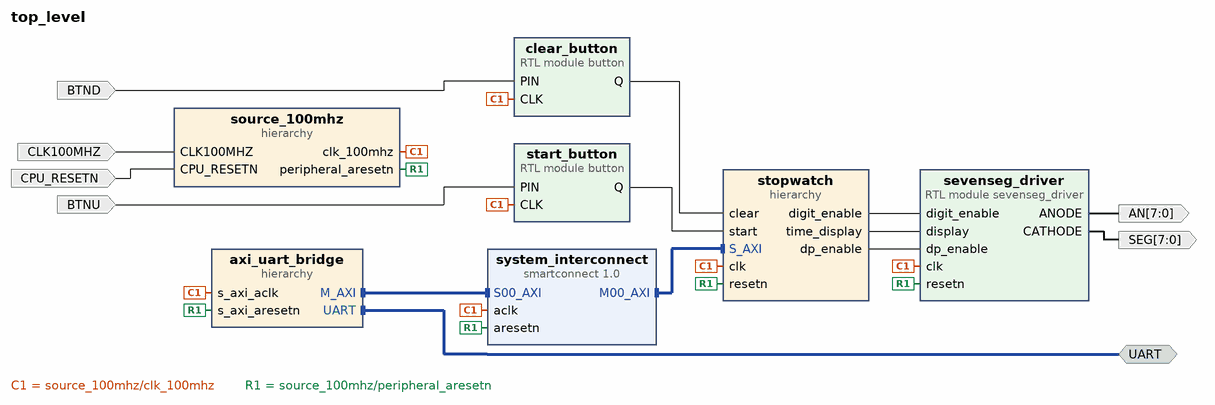
[diagram p0: block diagram of the top level]
# Vivado block design top_level, xc7a100tcsg324-1, Vivado 2021.1
create_bd_design top_level

create_bd_intf_port -mode Master -vlnv xilinx.com:interface:uart_rtl:1.0 UART
create_bd_port -dir I -type clk CLK100MHZ
create_bd_port -dir I -type rst CPU_RESETN
create_bd_port -dir O -from 7 -to 0 AN
create_bd_port -dir O -from 7 -to 0 SEG
create_bd_port -dir I BTNU
create_bd_port -dir I BTND

create_bd_cell -type hier source_100mhz
create_bd_cell -type ip -vlnv xilinx.com:ip:smartconnect:1.0 system_interconnect
set_property -dict {CONFIG.NUM_SI 1} [get_bd_cells system_interconnect]
create_bd_cell -type hier axi_uart_bridge
create_bd_cell -type module -reference sevenseg_driver sevenseg_driver
create_bd_cell -type module -reference button start_button
create_bd_cell -type module -reference button clear_button
create_bd_cell -type hier stopwatch

# ---- hierarchy /source_100mhz ----
current_bd_instance /source_100mhz
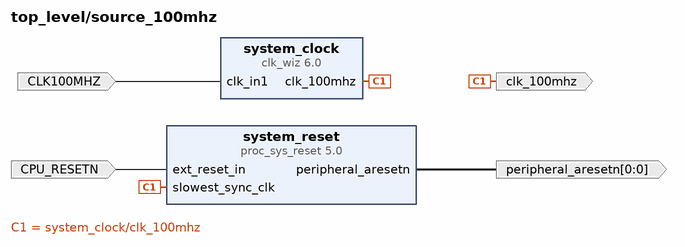
[diagram p1: block diagram inside /source_100mhz]
create_bd_pin -dir I -type clk CLK100MHZ
create_bd_pin -dir I -type rst CPU_RESETN
create_bd_pin -dir O -from 0 -to 0 peripheral_aresetn
create_bd_pin -dir O clk_100mhz

create_bd_cell -type ip -vlnv xilinx.com:ip:clk_wiz:6.0 system_clock
set_property -dict {CONFIG.CLK_OUT1_PORT clk_100mhz CONFIG.USE_LOCKED false CONFIG.USE_RESET false} [get_bd_cells system_clock]
create_bd_cell -type ip -vlnv xilinx.com:ip:proc_sys_reset:5.0 system_reset

# ---- hierarchy /axi_uart_bridge ----
current_bd_instance /axi_uart_bridge
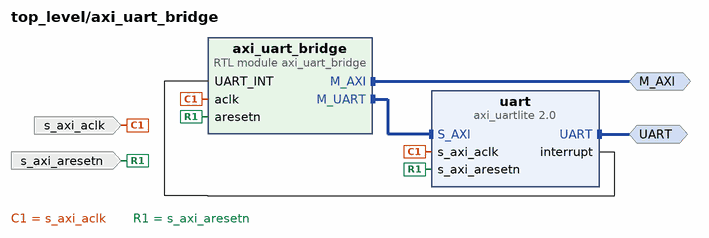
[diagram p2: block diagram inside /axi_uart_bridge]
create_bd_intf_pin -mode Master -vlnv xilinx.com:interface:aximm_rtl:1.0 M_AXI
create_bd_intf_pin -mode Master -vlnv xilinx.com:interface:uart_rtl:1.0 UART
create_bd_pin -dir I -type clk s_axi_aclk
create_bd_pin -dir I -type rst s_axi_aresetn

create_bd_cell -type module -reference axi_uart_bridge axi_uart_bridge
create_bd_cell -type ip -vlnv xilinx.com:ip:axi_uartlite:2.0 uart
set_property -dict {CONFIG.C_BAUDRATE 115200} [get_bd_cells uart]

# ---- hierarchy /stopwatch ----
current_bd_instance /stopwatch
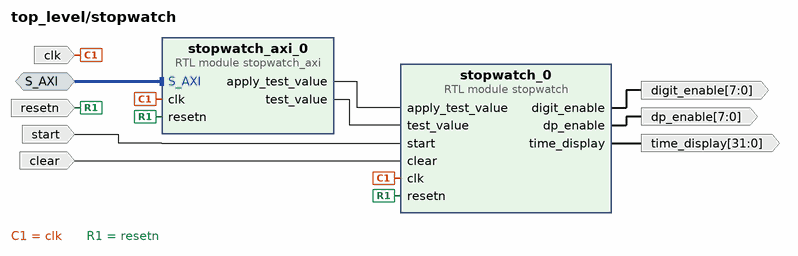
[diagram p3: block diagram inside /stopwatch]
create_bd_intf_pin -mode Slave -vlnv xilinx.com:interface:aximm_rtl:1.0 S_AXI
create_bd_pin -dir I -type clk clk
create_bd_pin -dir I -type rst resetn
create_bd_pin -dir O -from 7 -to 0 dp_enable
create_bd_pin -dir O -from 7 -to 0 digit_enable
create_bd_pin -dir O -from 31 -to 0 time_display
create_bd_pin -dir I clear
create_bd_pin -dir I start

create_bd_cell -type module -reference stopwatch_axi stopwatch_axi_0
create_bd_cell -type module -reference stopwatch stopwatch_0

# ---- connections ----

current_bd_instance /source_100mhz
connect_bd_net -net clk_in1_0_1 [get_bd_pins CLK100MHZ] [get_bd_pins system_clock/clk_in1]
connect_bd_net -net ext_reset_in_0_1 [get_bd_pins CPU_RESETN] [get_bd_pins system_reset/ext_reset_in]
connect_bd_net -net proc_sys_reset_0_peripheral_aresetn [get_bd_pins system_reset/peripheral_aresetn] [get_bd_pins peripheral_aresetn]
connect_bd_net [get_bd_pins system_clock/clk_100mhz] [get_bd_pins system_reset/slowest_sync_clk] [get_bd_pins clk_100mhz]

current_bd_instance /axi_uart_bridge
connect_bd_intf_net [get_bd_intf_pins M_AXI] [get_bd_intf_pins axi_uart_bridge/M_AXI]
connect_bd_intf_net [get_bd_intf_pins uart/S_AXI] [get_bd_intf_pins axi_uart_bridge/M_UART]
connect_bd_intf_net [get_bd_intf_pins UART] [get_bd_intf_pins uart/UART]
connect_bd_net -net source_100mhz_clk_100mhz [get_bd_pins s_axi_aclk] [get_bd_pins uart/s_axi_aclk] [get_bd_pins axi_uart_bridge/aclk]
connect_bd_net -net source_100mhz_peripheral_aresetn [get_bd_pins s_axi_aresetn] \
  [get_bd_pins uart/s_axi_aresetn] [get_bd_pins axi_uart_bridge/aresetn]
connect_bd_net [get_bd_pins uart/interrupt] [get_bd_pins axi_uart_bridge/UART_INT]

current_bd_instance /stopwatch
connect_bd_intf_net -intf_net system_interconnect_M00_AXI [get_bd_intf_pins S_AXI] [get_bd_intf_pins stopwatch_axi_0/S_AXI]
connect_bd_net -net button_0_Q [get_bd_pins start] [get_bd_pins stopwatch_0/start]
connect_bd_net -net clear_button_Q [get_bd_pins clear] [get_bd_pins stopwatch_0/clear]
connect_bd_net -net source_100mhz_clk_100mhz [get_bd_pins clk] [get_bd_pins stopwatch_axi_0/clk] [get_bd_pins stopwatch_0/clk]
connect_bd_net -net source_100mhz_peripheral_aresetn [get_bd_pins resetn] [get_bd_pins stopwatch_axi_0/resetn] [get_bd_pins stopwatch_0/resetn]
connect_bd_net [get_bd_pins stopwatch_0/digit_enable] [get_bd_pins digit_enable]
connect_bd_net -net stopwatch_0_display [get_bd_pins stopwatch_0/time_display] [get_bd_pins time_display]
connect_bd_net [get_bd_pins stopwatch_0/dp_enable] [get_bd_pins dp_enable]
connect_bd_net [get_bd_pins stopwatch_axi_0/apply_test_value] [get_bd_pins stopwatch_0/apply_test_value]
connect_bd_net [get_bd_pins stopwatch_axi_0/test_value] [get_bd_pins stopwatch_0/test_value]

current_bd_instance /
connect_bd_intf_net [get_bd_intf_pins axi_uart_bridge/M_AXI] [get_bd_intf_pins system_interconnect/S00_AXI]
connect_bd_intf_net [get_bd_intf_pins system_interconnect/M00_AXI] [get_bd_intf_pins stopwatch/S_AXI]
connect_bd_intf_net -intf_net uart_UART [get_bd_intf_ports UART] [get_bd_intf_pins axi_uart_bridge/UART]
connect_bd_net [get_bd_ports BTND] [get_bd_pins clear_button/PIN]
connect_bd_net [get_bd_ports BTNU] [get_bd_pins start_button/PIN]
connect_bd_net -net button_0_Q [get_bd_pins start_button/Q] [get_bd_pins stopwatch/start]
connect_bd_net [get_bd_pins clear_button/Q] [get_bd_pins stopwatch/clear]
connect_bd_net -net clk_in1_0_1 [get_bd_ports CLK100MHZ] [get_bd_pins source_100mhz/CLK100MHZ]
connect_bd_net -net ext_reset_in_0_1 [get_bd_ports CPU_RESETN] [get_bd_pins source_100mhz/CPU_RESETN]
connect_bd_net [get_bd_pins sevenseg_driver/ANODE] [get_bd_ports AN]
connect_bd_net [get_bd_pins sevenseg_driver/CATHODE] [get_bd_ports SEG]
connect_bd_net [get_bd_pins source_100mhz/clk_100mhz] \
  [get_bd_pins system_interconnect/aclk] [get_bd_pins axi_uart_bridge/s_axi_aclk] [get_bd_pins sevenseg_driver/clk] \
  [get_bd_pins start_button/CLK] [get_bd_pins clear_button/CLK] [get_bd_pins stopwatch/clk]
connect_bd_net [get_bd_pins source_100mhz/peripheral_aresetn] \
  [get_bd_pins system_interconnect/aresetn] [get_bd_pins axi_uart_bridge/s_axi_aresetn] [get_bd_pins sevenseg_driver/resetn] \
  [get_bd_pins stopwatch/resetn]
connect_bd_net -net stopwatch_0_digit_enable [get_bd_pins stopwatch/digit_enable] [get_bd_pins sevenseg_driver/digit_enable]
connect_bd_net -net stopwatch_0_display [get_bd_pins stopwatch/time_display] [get_bd_pins sevenseg_driver/display]
connect_bd_net -net stopwatch_0_dp_enable [get_bd_pins stopwatch/dp_enable] [get_bd_pins sevenseg_driver/dp_enable]

# ---- address map ----
assign_bd_address -offset 0x0000000044A00000 -range 64K -target_address_space [get_bd_addr_spaces axi_uart_bridge/axi_uart_bridge/M_AXI] [get_bd_addr_segs stopwatch/stopwatch_axi_0/S_AXI/reg0]
assign_bd_address -offset 0x40600000 -range 64K -target_address_space [get_bd_addr_spaces axi_uart_bridge/axi_uart_bridge/M_UART] [get_bd_addr_segs axi_uart_bridge/uart/S_AXI/Reg]

validate_bd_design
save_bd_design
